# EAGLE design Bolt (EAGLE 9.6.2)

## Sheet 1 of 5: Power supply
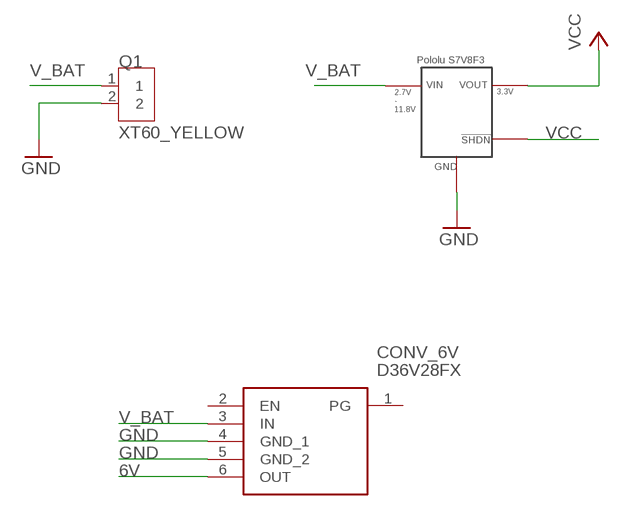
[diagram p0: schematic, sheet 1]

### Parts
CONV_3V3  S7V8F3  [S7V8F3]
CONV_6V  D36V28FX  [D36V28FX]
Q1  XT60_YELLOW  [AMASS_XT60PB-M]

### Nets
6V: CONV_6V.6(OUT) ; also sheet 3
GND: CONV_3V3.GND CONV_6V.4(GND_1) CONV_6V.5(GND_2) Q1.2 ; also sheet 2,3,4,5
V_BAT: CONV_3V3.VIN CONV_6V.3(IN) Q1.1
VCC: CONV_3V3.!SHDN CONV_3V3.VOUT ; also sheet 2,3,4,5
Unconnected: CONV_6V.1(PG) CONV_6V.2(EN)

## Sheet 2 of 5: MCU
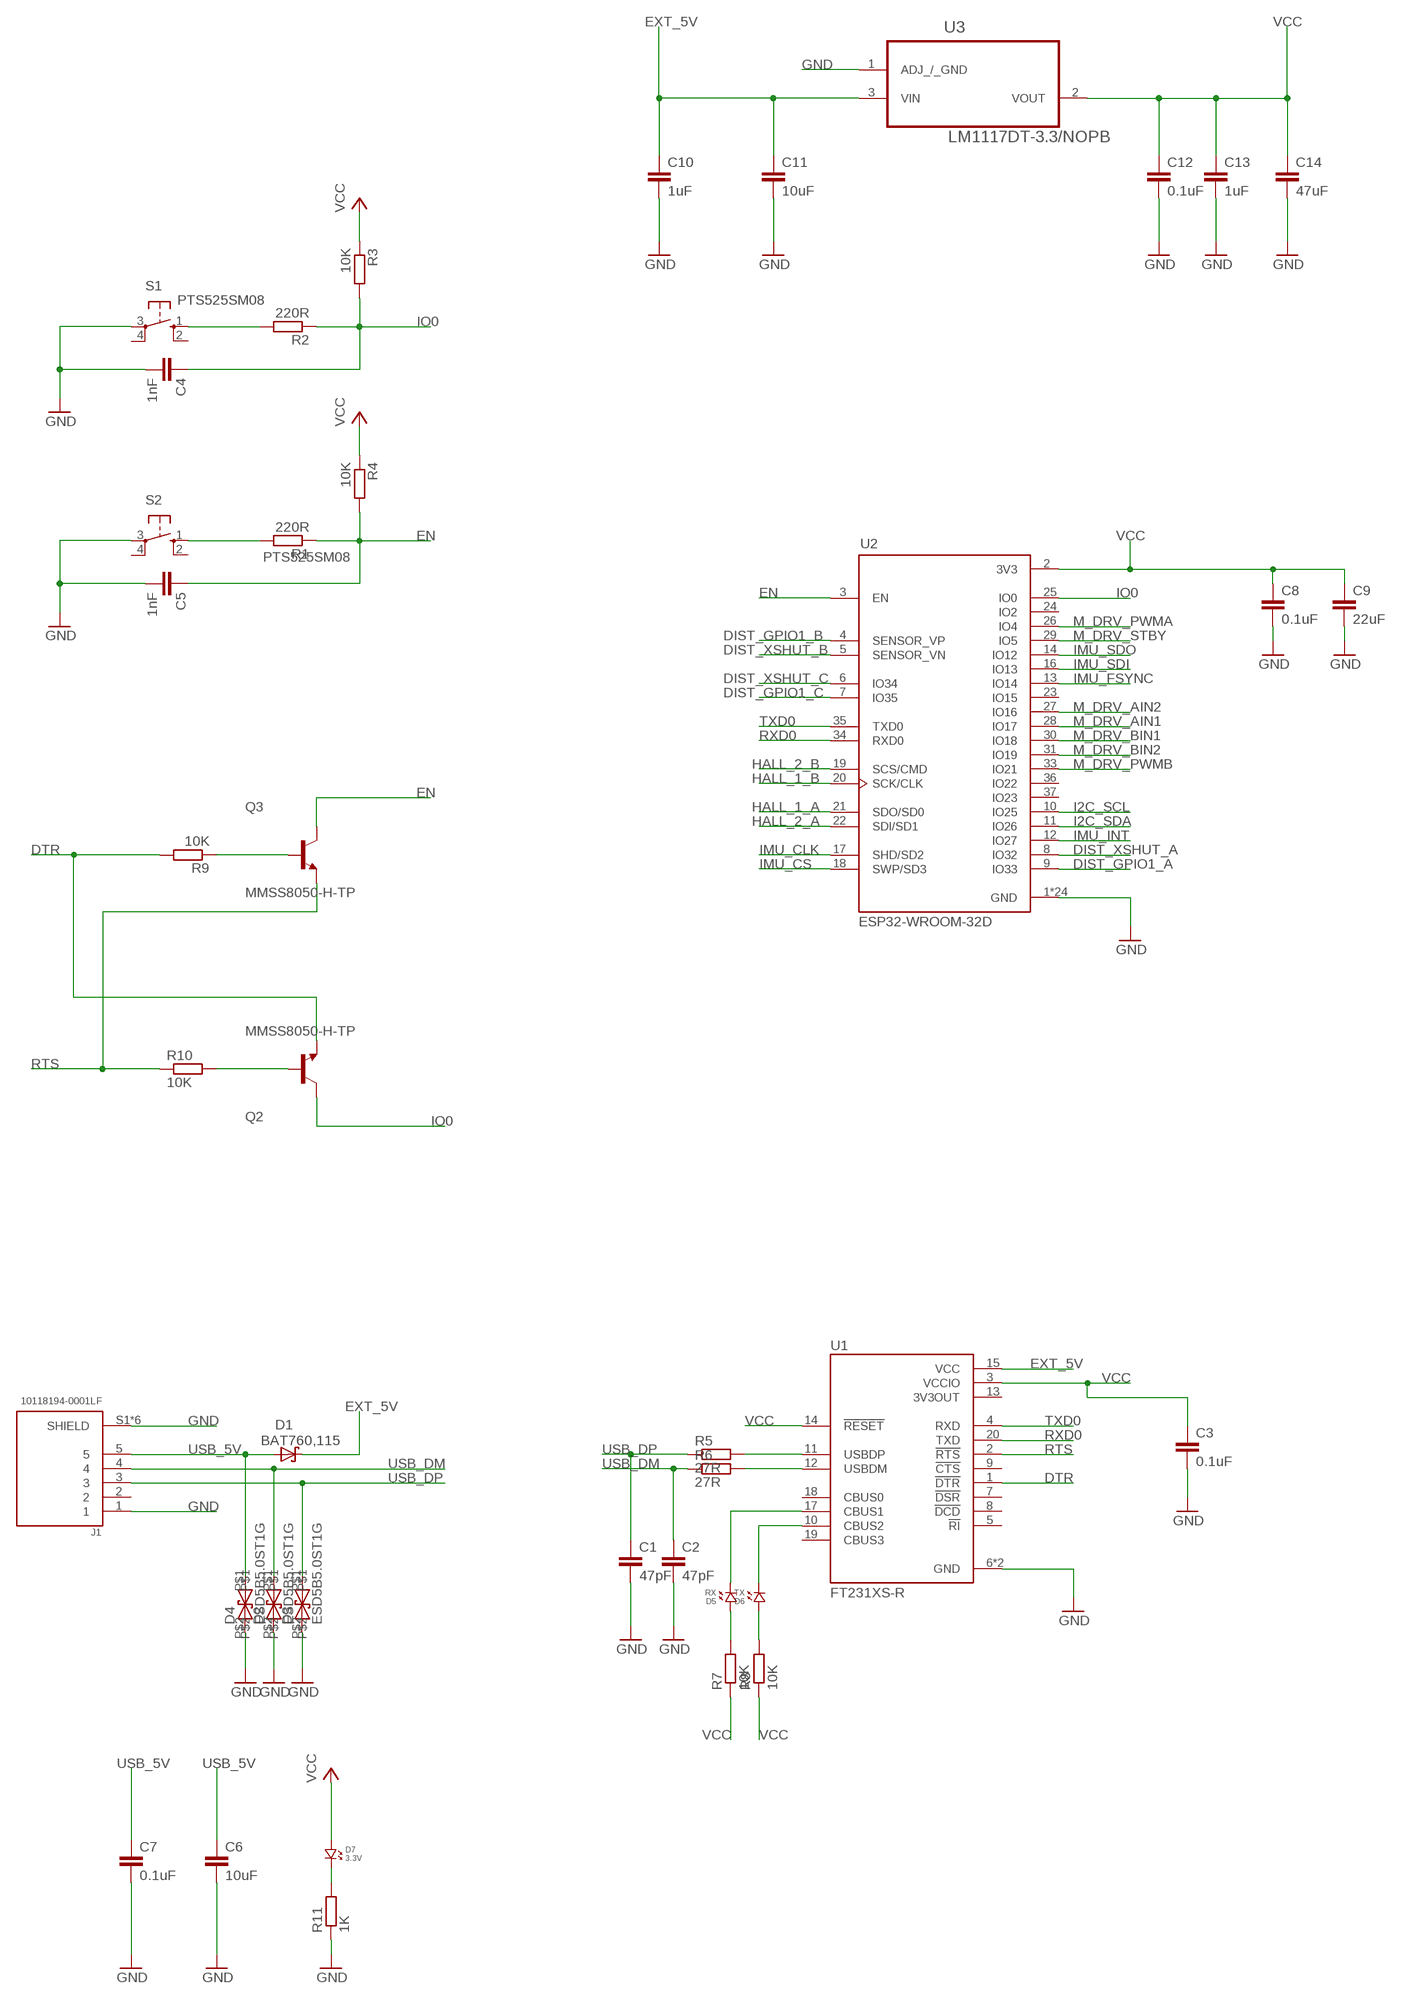
[diagram p1: schematic, sheet 2]

### Parts
C1  47pF  C-EUC0805K  [C0805K]
C2  47pF  C-EUC0805K  [C0805K]
C3  0.1uF  C-EUC0805K  [C0805K]
C4  1nF  C-EUC0805K  [C0805K]
C5  1nF  C-EUC0805K  [C0805K]
C6  10uF  C-EUC0805K  [C0805K]
C7  0.1uF  C-EUC0805K  [C0805K]
C8  0.1uF  C-EUC0805K  [C0805K]
C9  22uF  C-EUC0805K  [C0805K]
C10  1uF  C-EUC0805K  [C0805K]
C11  10uF  C-EUC0805K  [C0805K]
C12  0.1uF  C-EUC0805K  [C0805K]
C13  1uF  C-EUC0805K  [C0805K]
C14  47uF  C-EUC0805K  [C0805K]
D1  BAT760,115  [SOD323(F)]
D2  ESD5B5.0ST1G  [SOD-523]
D3  ESD5B5.0ST1G  [SOD-523]
D4  ESD5B5.0ST1G  [SOD-523]
D5  RX  LED.0805  [0805.LED]
D6  TX  LED.0805  [0805.LED]
D7  3.3V  LED.0805  [0805.LED]
J1  10118194-0001LF  [AMPHENOL_10118194-0001LF]
Q2  MMSS8050-H-TP  [TRANS_MMSS8050-H-TP]
Q3  MMSS8050-H-TP  [TRANS_MMSS8050-H-TP]
R1  220R  R-EU_R0805  [R0805]
R2  220R  R-EU_R0805  [R0805]
R3  10K  R-EU_R0805  [R0805]
R4  10K  R-EU_R0805  [R0805]
R5  27R  R-EU_R0805  [R0805]
R6  27R  R-EU_R0805  [R0805]
R7  10K  R-EU_R0805  [R0805]
R8  10K  R-EU_R0805  [R0805]
R9  10K  R-EU_R0805  [R0805]
R10  10K  R-EU_R0805  [R0805]
R11  1K  R-EU_R0805  [R0805]
S1  PTS525SM08  [SM08]
S2  PTS525SM08  [SM08]
U1  FT231XS-R  [SOP63P599X175-20N]
U2  ESP32-WROOM-32D  [MODULE_ESP32-WROOM-32D]
U3  LM1117DT-3.3/NOPB  [TO228P970X238-3N]

### Nets
DIST_GPIO1_A: U2.9(IO33) ; also sheet 5
DIST_GPIO1_B: U2.4(SENSOR_VP) ; also sheet 5
DIST_GPIO1_C: U2.7(IO35) ; also sheet 5
DIST_XSHUT_A: U2.8(IO32) ; also sheet 5
DIST_XSHUT_B: U2.5(SENSOR_VN) ; also sheet 5
DIST_XSHUT_C: U2.6(IO34) ; also sheet 5
DTR: Q2.2(E) R9.2 U1.1(!DTR)
EN: C5.1 Q3.3(C) R1.1 R4.2 U2.3(EN)
EXT_5V: C10.1 C11.1 D1.1(K) U1.15(VCC) U3.3(VIN)
GND: C1.2 C2.2 C3.2 C4.2 C5.2 C6.2 C7.2 C8.2 C9.2 C10.2 C11.2 C12.2 C13.2 C14.2 D2.P$2 D3.P$2 D4.P$2 J1.1 J1.S1(SHIELD) J1.S2(SHIELD) J1.S3(SHIELD) J1.S4(SHIELD) J1.S5(SHIELD) J1.S6(SHIELD) R11.1 S1.3(P) S2.3(P) U1.6(GND) U1.16(GND) U2.1(GND) U2.15(GND) U2.38(GND) U2.39_1(GND) U2.39_2(GND) U2.39_3(GND) U2.39_4(GND) U2.39_5(GND) U2.39_6(GND) U2.39_7(GND) U2.39_8(GND) U2.39_9(GND) U2.39_10(GND) U2.39_11(GND) U2.39_12(GND) U2.39_13(GND) U2.39_14(GND) U2.39_15(GND) U2.39_16(GND) U2.39_17(GND) U2.39_18(GND) U2.39_19(GND) U2.39_20(GND) U2.39_21(GND) U3.1(ADJ_/_GND) ; also sheet 1,3,4,5
HALL_1_A: U2.21(SDO/SD0) ; also sheet 5
HALL_1_B: U2.20(SCK/CLK) ; also sheet 5
HALL_2_A: U2.22(SDI/SD1) ; also sheet 5
HALL_2_B: U2.19(SCS/CMD) ; also sheet 5
I2C_SCL: U2.10(IO25) ; also sheet 5
I2C_SDA: U2.11(IO26) ; also sheet 5
IMU_CLK: U2.17(SHD/SD2) ; also sheet 4
IMU_CS: U2.18(SWP/SD3) ; also sheet 4
IMU_FSYNC: U2.13(IO14) ; also sheet 4
IMU_INT: U2.12(IO27) ; also sheet 4
IMU_SDI: U2.16(IO13) ; also sheet 4
IMU_SDO: U2.14(IO12) ; also sheet 4
IO0: C4.1 Q2.3(C) R2.1 R3.2 U2.25(IO0)
M_DRV_AIN1: U2.28(IO17) ; also sheet 3
M_DRV_AIN2: U2.27(IO16) ; also sheet 3
M_DRV_BIN1: U2.30(IO18) ; also sheet 3
M_DRV_BIN2: U2.31(IO19) ; also sheet 3
M_DRV_PWMA: U2.26(IO4) ; also sheet 3
M_DRV_PWMB: U2.33(IO21) ; also sheet 3
M_DRV_STBY: U2.29(IO5) ; also sheet 3
N$1: Q2.1(B) R10.2
N$28: D7.P$2 R11.2
N$35: D5.P$1 R7.2
N$55: R5.2 U1.11(USBDP)
N$56: R6.2 U1.12(USBDM)
N$61: R2.2 S1.1(S)
N$62: R1.2 S2.1(S)
N$124: Q3.1(B) R9.1
N$126: D5.P$2 U1.17(CBUS1)
N$127: D6.P$2 U1.10(CBUS2)
N$129: D6.P$1 R8.2
RTS: Q3.2(E) R10.1 U1.2(!RTS)
RXD0: U1.20(TXD) U2.34(RXD0)
TXD0: U1.4(RXD) U2.35(TXD0)
USB_5V: C6.1 C7.1 D1.2(A) D4.P$1 J1.5
USB_DM: C2.1 D2.P$1 J1.4 R6.1
USB_DP: C1.1 D3.P$1 J1.3 R5.1
VCC: C3.1 C8.1 C9.1 C12.1 C13.1 C14.1 D7.P$1 R3.1 R4.1 R7.1 R8.1 U1.3(VCCIO) U1.14(!RESET) U2.2(3V3) U3.2(VOUT) ; also sheet 1,3,4,5
Unconnected: J1.2 S1.2(S) S1.4(P) S2.2(S) S2.4(P) U1.5(!RI) U1.7(!DSR) U1.8(!DCD) U1.9(!CTS) U1.18(CBUS0) U1.19(CBUS3) U2.23(IO15) U2.24(IO2) U2.36(IO22) U2.37(IO23)

## Sheet 3 of 5: Motors driver
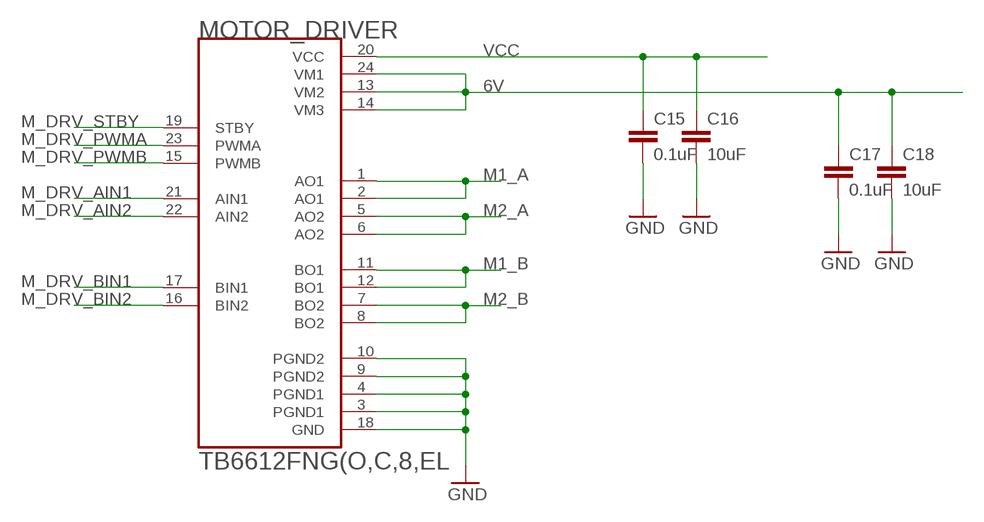
[diagram p2: schematic, sheet 3]

### Parts
C15  0.1uF  C-EUC0805K  [C0805K]
C16  10uF  C-EUC0805K  [C0805K]
C17  0.1uF  C-EUC0805K  [C0805K]
C18  10uF  C-EUC0805K  [C0805K]
MOTOR_DRIVER  TB6612FNG(O,C,8,EL  [SOP65P760X160-24N]

### Nets
6V: C17.1 C18.1 MOTOR_DRIVER.13(VM2) MOTOR_DRIVER.14(VM3) MOTOR_DRIVER.24(VM1) ; also sheet 1
GND: C15.2 C16.2 C17.2 C18.2 MOTOR_DRIVER.3(PGND1) MOTOR_DRIVER.4(PGND1) MOTOR_DRIVER.9(PGND2) MOTOR_DRIVER.10(PGND2) MOTOR_DRIVER.18(GND) ; also sheet 1,2,4,5
M1_A: MOTOR_DRIVER.1(AO1) MOTOR_DRIVER.2(AO1) ; also sheet 5
M1_B: MOTOR_DRIVER.11(BO1) MOTOR_DRIVER.12(BO1) ; also sheet 5
M2_A: MOTOR_DRIVER.5(AO2) MOTOR_DRIVER.6(AO2) ; also sheet 5
M2_B: MOTOR_DRIVER.7(BO2) MOTOR_DRIVER.8(BO2) ; also sheet 5
M_DRV_AIN1: MOTOR_DRIVER.21(AIN1) ; also sheet 2
M_DRV_AIN2: MOTOR_DRIVER.22(AIN2) ; also sheet 2
M_DRV_BIN1: MOTOR_DRIVER.17(BIN1) ; also sheet 2
M_DRV_BIN2: MOTOR_DRIVER.16(BIN2) ; also sheet 2
M_DRV_PWMA: MOTOR_DRIVER.23(PWMA) ; also sheet 2
M_DRV_PWMB: MOTOR_DRIVER.15(PWMB) ; also sheet 2
M_DRV_STBY: MOTOR_DRIVER.19(STBY) ; also sheet 2
VCC: C15.1 C16.1 MOTOR_DRIVER.20(VCC) ; also sheet 1,2,4,5

## Sheet 4 of 5: IMU
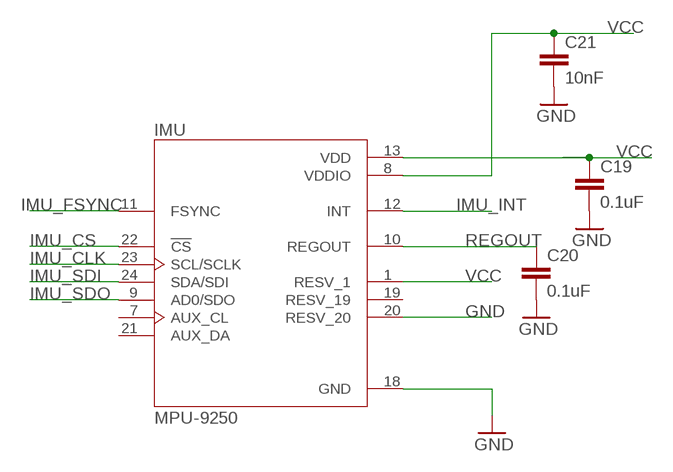
[diagram p3: schematic, sheet 4]

### Parts
C19  0.1uF  C-EUC0805K  [C0805K]
C20  0.1uF  C-EUC0805K  [C0805K]
C21  10nF  C-EUC0805K  [C0805K]
IMU  MPU-9250  [QFN40P300X300X105-24N]

### Nets
GND: C19.2 C20.2 C21.2 IMU.18(GND) IMU.20(RESV_20) ; also sheet 1,2,3,5
IMU_CLK: IMU.23(SCL/SCLK) ; also sheet 2
IMU_CS: IMU.22(!CS) ; also sheet 2
IMU_FSYNC: IMU.11(FSYNC) ; also sheet 2
IMU_INT: IMU.12(INT) ; also sheet 2
IMU_SDI: IMU.24(SDA/SDI) ; also sheet 2
IMU_SDO: IMU.9(AD0/SDO) ; also sheet 2
REGOUT: C20.1 IMU.10(REGOUT)
VCC: C19.1 C21.1 IMU.1(RESV_1) IMU.8(VDDIO) IMU.13(VDD) ; also sheet 1,2,3,5
Unconnected: IMU.7(AUX_CL) IMU.19(RESV_19) IMU.21(AUX_DA)

## Sheet 5 of 5: External pins
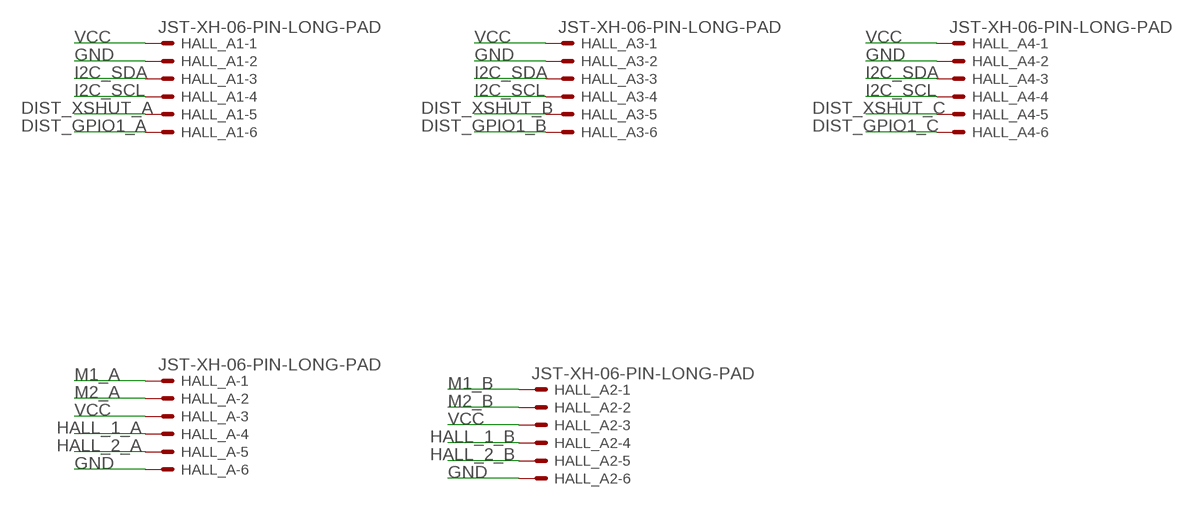
[diagram p4: schematic, sheet 5]

### Parts
HALL_A  JST-XH-06-PIN-LONG-PAD  [JST-XH-06-PACKAGE-LONG-PAD]
HALL_A1  JST-XH-06-PIN-LONG-PAD  [JST-XH-06-PACKAGE-LONG-PAD]
HALL_A2  JST-XH-06-PIN-LONG-PAD  [JST-XH-06-PACKAGE-LONG-PAD]
HALL_A3  JST-XH-06-PIN-LONG-PAD  [JST-XH-06-PACKAGE-LONG-PAD]
HALL_A4  JST-XH-06-PIN-LONG-PAD  [JST-XH-06-PACKAGE-LONG-PAD]

### Nets
DIST_GPIO1_A: HALL_A1.6 ; also sheet 2
DIST_GPIO1_B: HALL_A3.6 ; also sheet 2
DIST_GPIO1_C: HALL_A4.6 ; also sheet 2
DIST_XSHUT_A: HALL_A1.5 ; also sheet 2
DIST_XSHUT_B: HALL_A3.5 ; also sheet 2
DIST_XSHUT_C: HALL_A4.5 ; also sheet 2
GND: HALL_A1.2 HALL_A2.6 HALL_A3.2 HALL_A4.2 HALL_A.6 ; also sheet 1,2,3,4
HALL_1_A: HALL_A.4 ; also sheet 2
HALL_1_B: HALL_A2.4 ; also sheet 2
HALL_2_A: HALL_A.5 ; also sheet 2
HALL_2_B: HALL_A2.5 ; also sheet 2
I2C_SCL: HALL_A1.4 HALL_A3.4 HALL_A4.4 ; also sheet 2
I2C_SDA: HALL_A1.3 HALL_A3.3 HALL_A4.3 ; also sheet 2
M1_A: HALL_A.1 ; also sheet 3
M1_B: HALL_A2.1 ; also sheet 3
M2_A: HALL_A.2 ; also sheet 3
M2_B: HALL_A2.2 ; also sheet 3
VCC: HALL_A1.1 HALL_A2.3 HALL_A3.1 HALL_A4.1 HALL_A.3 ; also sheet 1,2,3,4

## Power pins joined to a net without a drawn wire
3V3OUT: U1.13(3V3OUT)

## Library data of the parts
C1-C21 = rcl:C-EU: CAPACITOR, European symbol; SPICEPREFIX: C
CONV_3V3 = Pololu_S7V8F3:S7V8F3: Pololu S7V8F3 - Pololu 3.3V Step-Up/Step-Down Voltage Regulator S7V8F3 - The S7V8F3 switching step-up/step-down regulator efficiently produces a fixed 3.3 V output from input voltages between 2.7 V and 11.8 V. Its ability to convert both higher and lower input voltages makes it useful for applications where the power supply voltage can vary greatly, as with batteries that start above but discharge below the regulated voltage. The compact module has a typical efficiency of over 90% and can deliver 500 mA to 1 A across most of the input voltage range.
CONV_6V = D36V28FX:D36V28FX: 5V, 3.2A Step-Down Voltage Regulator D36V28F5 Source: Datasheet <https://www.pololu.com/product/3782>; DESCRIPTION: 5V, 3.2A Step-Down Voltage Regulator D36V28F5; HEIGHT: 8.77mm; MANUFACTURER_NAME: POLOLU ROBOTICS & ELECTRONICS; MANUFACTURER_PART_NUMBER: D36V28FX
D1 = BAT760_115:BAT760,115: Medium power Schottky barrier single diode Planar medium power Schottky barrier single diode with an integrated guard ring for stress protection, encapsulated in a SOD323 (SC-76) very small Surface-Mounted Device SMD plastic package. AAL Eindhoven MK Check prices <https://pricing.snapeda.com/parts/BAT760%2C115/Nexperia%20USA/view-part?ref=eda>; AVAILABILITY: Good; DESCRIPTION: Diode Schottky 20V 1A (DC) Surface Mount SOD-323; MF: Nexperia USA; MP: BAT760,115; PACKAGE: SOD323-2 Nexperia USA Inc.; PRICE: None; PURCHASE-URL: https://pricing.snapeda.com/search/part/BAT760,115/?ref=eda
D2-D4 = ESD5B5.0ST1G:ESD5B5.0ST1G: Medium power Schottky barrier single diode Planar medium power Schottky barrier single diode with an integrated guard ring for stress protection, encapsulated in a SOD323 (SC-76) very small Surface-Mounted Device SMD plastic package. AAL Eindhoven MK Check prices <https://pricing.snapeda.com/parts/BAT760%2C115/Nexperia%20USA/view-part?ref=eda>; AVAILABILITY: Good; DESCRIPTION: Diode Schottky 20V 1A (DC) Surface Mount SOD-323; MF: Nexperia USA; MP: BAT760,115; PACKAGE: SOD323-2 Nexperia USA Inc.; PRICE: None; PURCHASE-URL: https://pricing.snapeda.com/search/part/BAT760,115/?ref=eda
D5-D7 = leds:LED
HALL_A HALL_A1-HALL_A4 = Rembrandt Electronics - JST XH Connectors v1-0:JST-XH-06-PIN: JST XH Connector 2 Pin Wire to board connector. Pitch: 2,54 mm, (0.100") Number of pins: 6 Created by Rembrandt Electronics www.rembrandtelectronics.com
IMU = MPU-9250:MPU-9250: Axis=3 Axis Gyro+3 Axis Accel+Compass. Pin For Pin With m Check prices <https://pricing.snapeda.com/parts/MPU-9250/TDK%20InvenSense/view-part?ref=eda>; AVAILABILITY: Bad; DESCRIPTION: Accelerometer, Gyroscope, Magnetometer, 9 Axis Sensor I²C, SPI Output; MF: TDK InvenSense; MP: MPU-9250; PACKAGE: TFQFN-24 TDK InvenSense; PRICE: None
J1 = 10118194-0001LF:10118194-0001LF: Micro Usb, 2.0 Type b, Rcpt, Smt Check prices <https://pricing.snapeda.com/parts/10118194-0001LF/Amphenol%20ICC%20%28FCI%29/view-part?ref=eda>; AVAILABILITY: Good; DESCRIPTION: USB - micro B USB 2.0 Receptacle Connector 5 Position Surface Mount, Right Angle; Through Hole; MF: Amphenol ICC (FCI); MP: 10118194-0001LF; PACKAGE: None; PRICE: None; PURCHASE-URL: https://pricing.snapeda.com/search/part/10118194-0001LF/?ref=eda
MOTOR_DRIVER = TB6612FNG_O_C_8_EL:TB6612FNG(O,C,8,EL: Stepping Motor Driver Ic Unipolor Copper Wire 8" Check prices <https://pricing.snapeda.com/parts/TB6612FNG%28O%2CC%2C8%2CEL/Toshiba/view-part?ref=eda>; AVAILABILITY: Good; DESCRIPTION: Motor Driver Power MOSFET Parallel 24-SSOP; MF: Toshiba; MP: TB6612FNG(O,C,8,EL; PACKAGE: SSOP-24 Toshiba; PRICE: None
Q1 = XT60_YELLOW:XT60_YELLOW: Connector 2 pins; AVAILABILITY: Unavailable; DESCRIPTION: Power connector; 65A; PIN: 2; Colour: yellow; MF: Pololu; MP: XT60 YELLOW; PACKAGE: None; PRICE: None
Q2 Q3 = MMSS8050-H-TP:MMSS8050-H-TP: MMSS8050-H Series 25 V 1.5 A NPN Silicon Plastic-Encapsulate Transistor-SOT-23 Check prices <https://pricing.snapeda.com/parts/MMSS8050-H-TP/Micro%20Commercial/view-part?ref=eda>; AVAILABILITY: Good; DESCRIPTION: Bipolar (BJT) Transistor NPN 25V 1.5A 100MHz 625mW Surface Mount SOT-23; MF: Micro Commercial; MP: MMSS8050-H-TP; PACKAGE: SOT-23 MCC; PRICE: None; PURCHASE-URL: https://pricing.snapeda.com/search/part/MMSS8050-H-TP/?ref=eda
R1-R11 = rcl:R-EU_: RESISTOR, European symbol; SPICEPREFIX: R
S1 S2 = pts525_20:PTS525*: PTS 525 Series Miniature Tact Switch for SMD Source: http://www.ck-components.com/14407/pts525_8sept14.pdf/; MF: C&K Components; MPN: PTS525SM08SMTR2LFS; OC_FARNELL: unknown; OC_NEWARK: unknown
U1 = FT231XS-R:FT231XS-R: USB Full Speed to Full Handshake UART with USB Charger Detection; DESCRIPTION: USB Bridge, USB to UART USB 2.0 UART Interface 20-SSOP; DIGI-KEY_PART_NUMBER: 768-1129-1-ND; MF: FTDI,; MP: FT231XS-R; PACKAGE: SSOP-20 FTDI; PURCHASE-URL: https://pricing.snapeda.com/search/part/FT231XS-R/?ref=eda
U2 = ESP32-WROOM-32D:ESP32-WROOM-32D: Bluetooth, WiFi 802.11b/g/n, Bluetooth v4.2 + EDR, Class 1, 2 and 3 Transceiver Module 2.4GHz ~ 2.5GHz Integrated, Trace Surface Mount Check prices <https://pricing.snapeda.com/parts/ESP32-WROOM-32D/Espressif%20Systems/view-part?ref=eda>; AVAILABILITY: Bad; DESCRIPTION: Bluetooth, WiFi 802.11b/g/n, Bluetooth v4.2 +EDR, Class 1, 2 and 3 Transceiver Module 2.4GHz ~ 2.5GHz Integrated, Trace Surface Mount; MF: Espressif Systems; MP: ESP32-WROOM-32D; PACKAGE: Module Espressif Systems; PRICE: None
U3 = LM1117DT-3.3_NOPB:LM1117DT-3.3/NOPB: IC, LDO VOLT REG, 3.3V, 0.8A Check prices <https://pricing.snapeda.com/parts/LM1117DT-3.3/NOPB/Texas%20Instruments/view-part?ref=eda>; AVAILABILITY: Good; DESCRIPTION: 800-mA 15-V linear voltage regulator 3-TO-252 0 to 125; MF: Texas Instruments; MP: LM1117DT-3.3/NOPB; PACKAGE: TO-252-3 Texas Instruments; PRICE: None; PURCHASE-URL: https://pricing.snapeda.com/search/part/LM1117DT-3.3/NOPB/?ref=eda

## Board
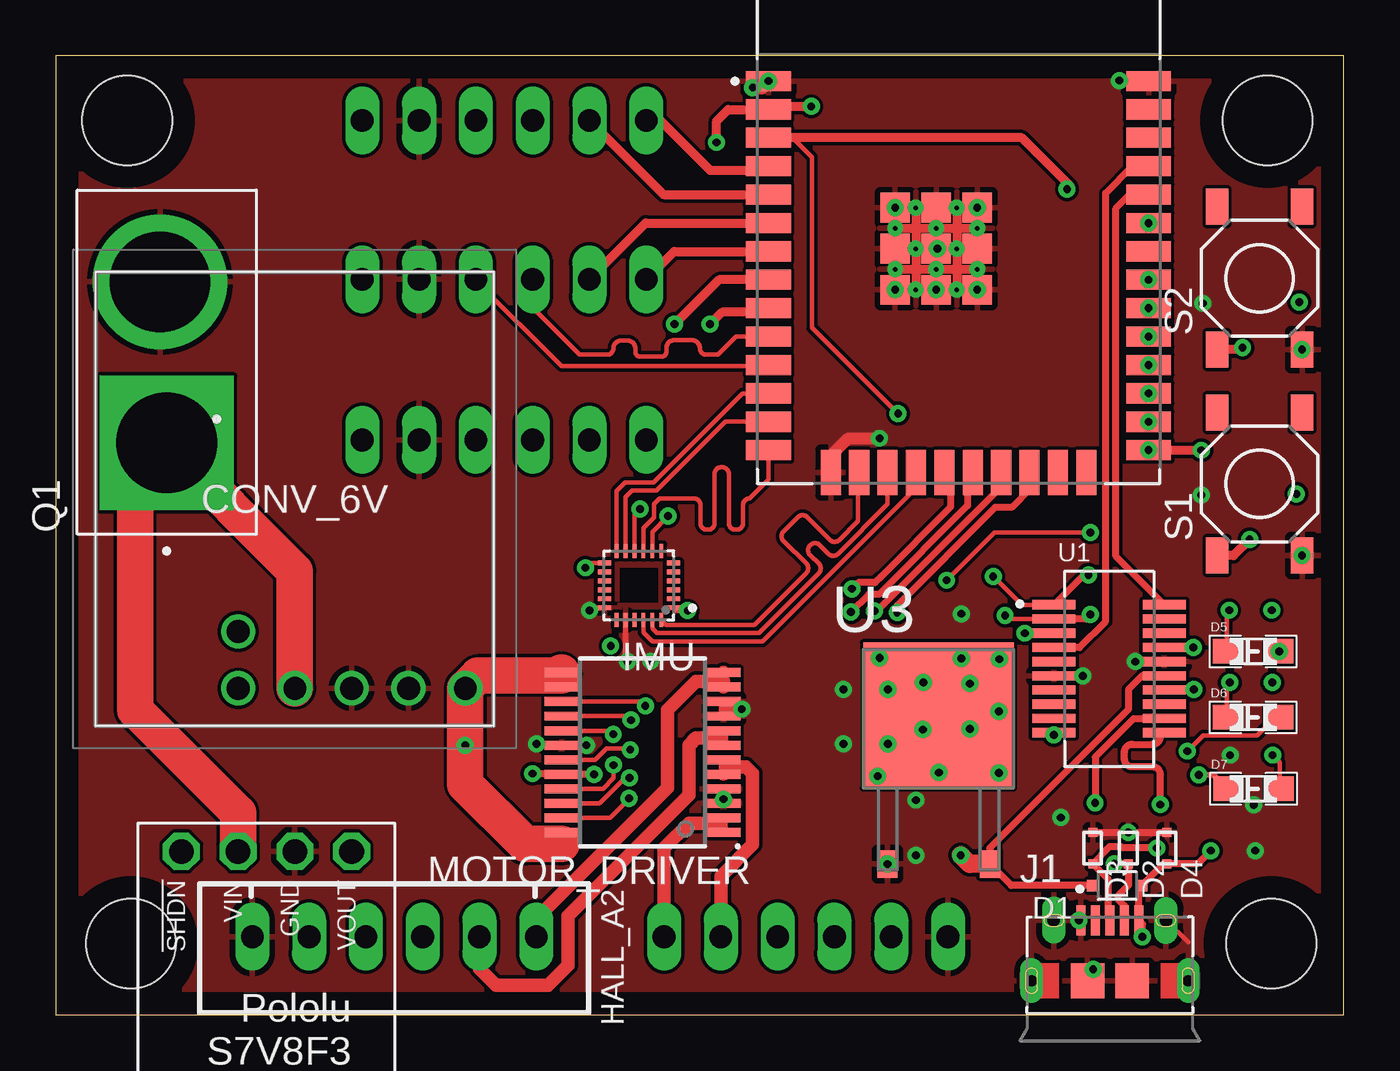
[diagram p5: board, top side]
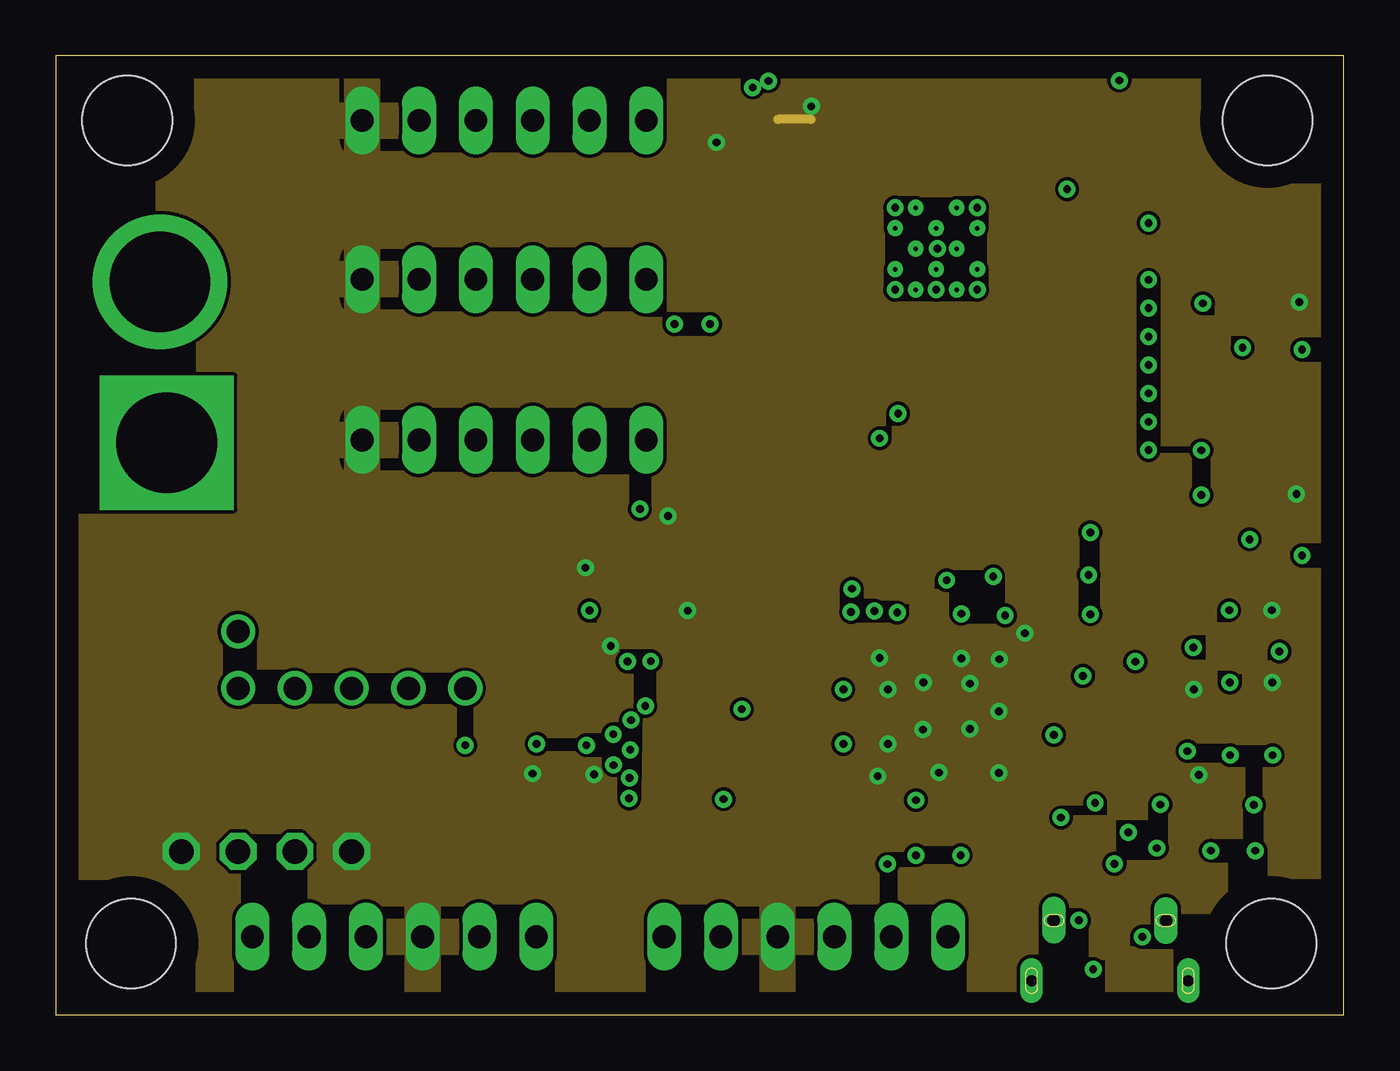
[diagram p6: board, inner layer VCC]
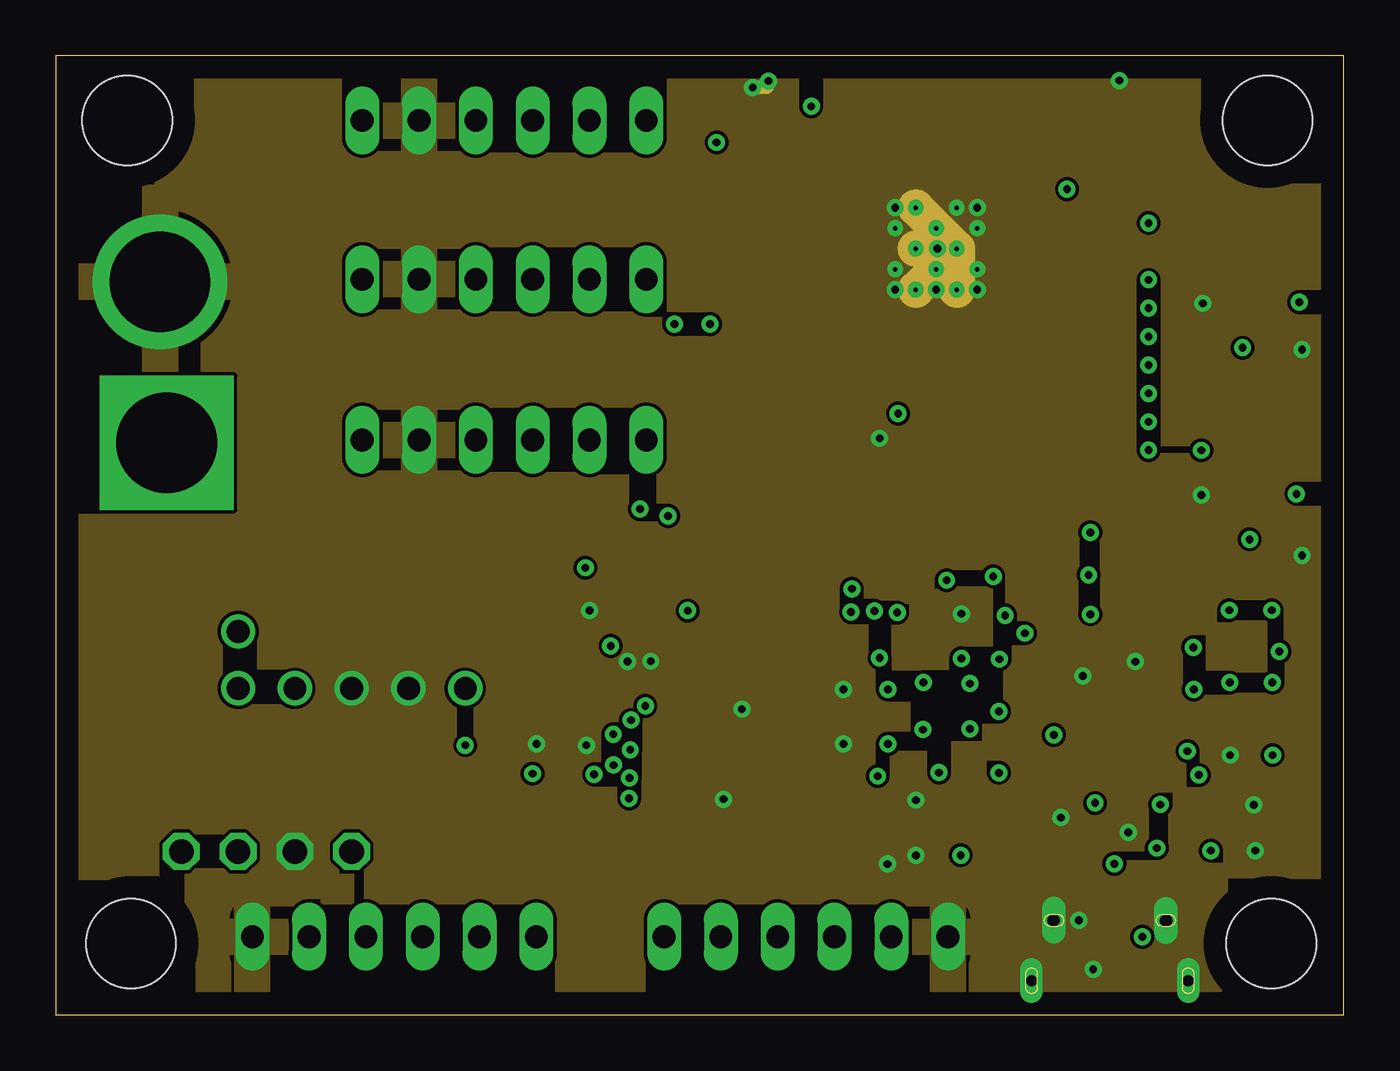
[diagram p7: board, inner layer GND]
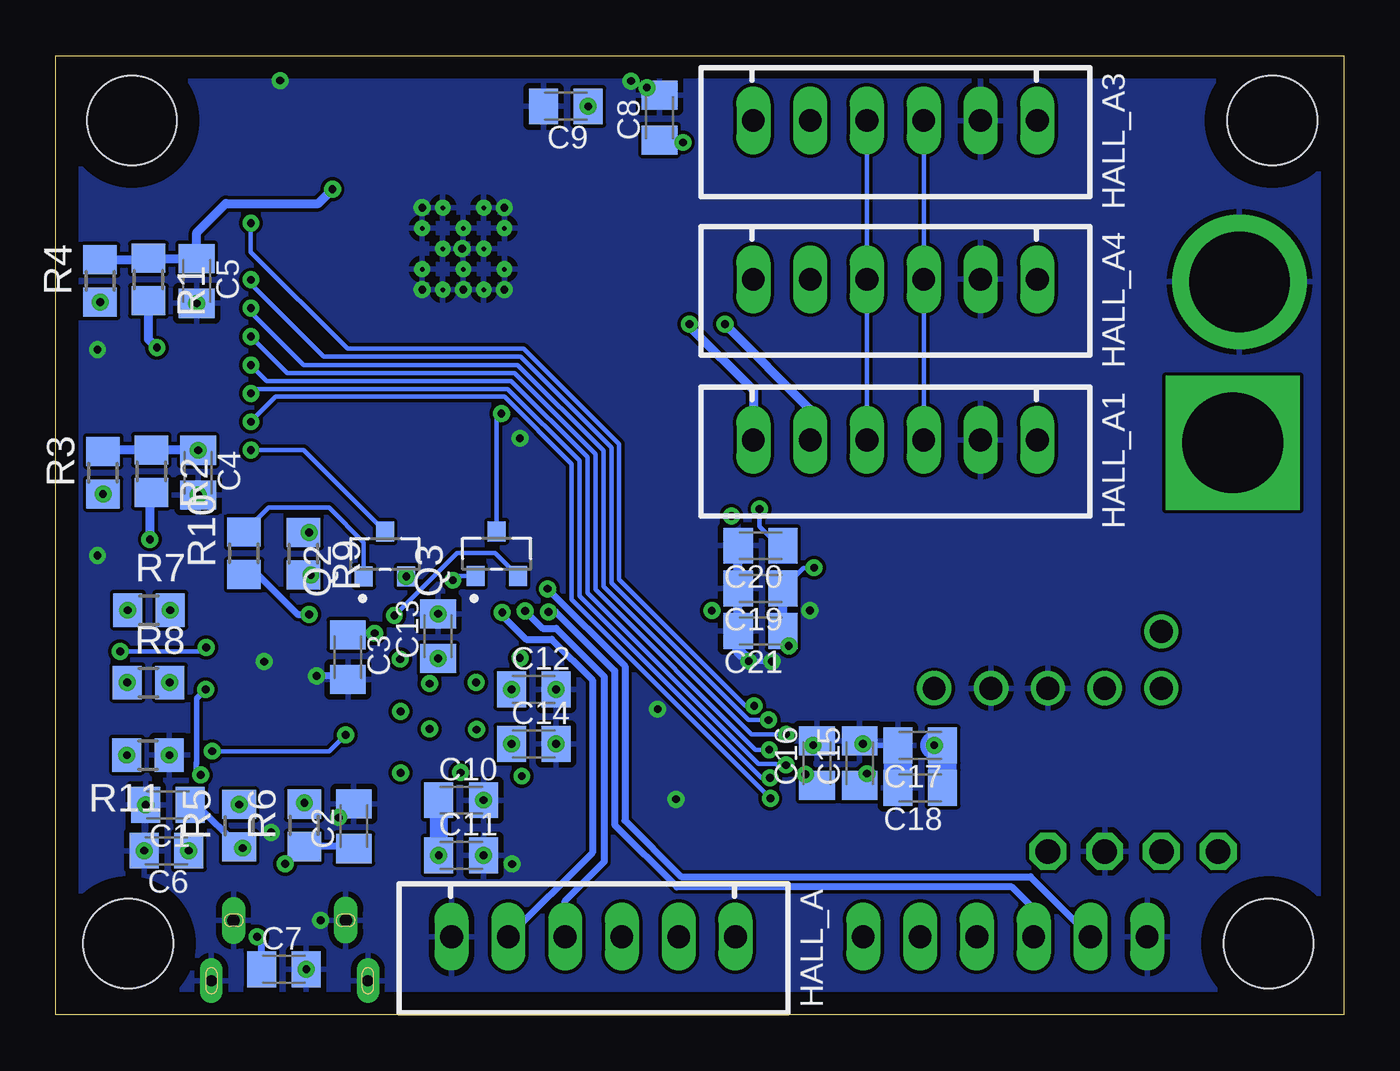
[diagram p8: board, bottom side, seen from below]

Size 57.59 x 42.9 mm. Coordinates in mm from the lower left corner, seen from the top.
Outline: 0,0 57.59,0 57.59,42.9 0,42.9 0,0
Copper layers (1+2*15+16): Top 0.035mm / dielectric 1.5mm / VCC 0.035mm / dielectric 0.15mm / GND 0.035mm / dielectric 0.2mm / Bottom 0.035mm
Design rules "default *": minimum track width 6mil, minimum drill 0.2mm, track to track 6mil, track to pad 6mil, pad to pad 6mil, via to via 6mil, smd to smd 6mil, copper to edge 40mil, drill to drill 6mil, minimum pad ring 10mil, minimum via ring 8mil, stop-mask expansion 4mil, vias tented up to drill 0mil, thermal gap 10mil
Holes 4 mm at 3.35,3.19 3.19,40.01 54.19,40.01 54.35,3.19

### Footprints (pad centres in the part's own frame; a part is rotated, then mirrored left to right if it is on the bottom)
C0805K = smd 1.3 x 1.6: 1 -1,0; 2 1,0
S7V8F3 = drill 1.1 octagon: !SHDN 3.81,0; GND -1.27,0; VIN 1.27,0; VOUT -3.81,0
D36V28FX = drill 1.02 pad 1.53: 1 0,0; 2 0,-2.54; 3 2.54,-2.54; 4 5.08,-2.54; 5 7.62,-2.54; 6 10.16,-2.54
SOD323(F) = smd 0.5 x 0.5: 1 1.1,0; 2 -1.1,0
SOD-523 = smd 0.4 x 0.4: P$1 0,-0.5; P$2 1.4,-0.5
0805.LED = smd 1.25 x 1.1: P$1 -1.175,0; P$2 1.175,0
JST-XH-06-PACKAGE-LONG-PAD = drill 1.016 long: 1 -6.35,0; 2 -3.81,0; 3 -1.27,0; 4 1.27,0; 5 3.81,0; 6 6.35,0
QFN40P300X300X105-24N = smd 0.64 x 0.22: 1 -1.545,1; 2 -1.545,0.6; 3 -1.545,0.2; 4 -1.545,-0.2; 5 -1.545,-0.6; 6 -1.545,-1; 13 1.545,-1; 14 1.545,-0.6; 15 1.545,-0.2; 16 1.545,0.2; 17 1.545,0.6; 18 1.545,1 | smd 0.22 x 0.64: 7 -1,-1.545; 8 -0.6,-1.545; 9 -0.2,-1.545; 10 0.2,-1.545; 11 0.6,-1.545; 12 1,-1.545; 19 1,1.545; 20 0.6,1.545; 21 0.2,1.545; 22 -0.2,1.545; 23 -0.6,1.545; 24 -1,1.545
AMPHENOL_10118194-0001LF = smd 0.4 x 1.35: 1 -1.3,2.7; 2 -0.65,2.7; 3 0,2.7; 4 0.65,2.7; 5 1.3,2.7 | drill 0.55 pad 0.65 long: S1 -2.511,2.706; S2 2.514,2.697 | drill 0.5 pad 0.775 long: S3 -3.5,0; S6 3.5,0 | smd 1.5 x 1.55: S4 -1,0; S5 1,0
SOP65P760X160-24N = smd 1.5 x 0.4: 1 -3.625,3.575; 2 -3.625,2.925; 3 -3.625,2.275; 4 -3.625,1.625; 5 -3.625,0.975; 6 -3.625,0.325; 7 -3.625,-0.325; 8 -3.625,-0.975; 9 -3.625,-1.625; 10 -3.625,-2.275; 11 -3.625,-2.925; 12 -3.625,-3.575; 13 3.625,-3.575; 14 3.625,-2.925; 15 3.625,-2.275; 16 3.625,-1.625; 17 3.625,-0.975; 18 3.625,-0.325; 19 3.625,0.325; 20 3.625,0.975; 21 3.625,1.625; 22 3.625,2.275; 23 3.625,2.925; 24 3.625,3.575
AMASS_XT60PB-M = drill 4.5 pad 6 square: 1 -3.6,0 | drill 4.5 pad 6: 2 3.6,0.305
TRANS_MMSS8050-H-TP = smd 0.9 x 0.8: 1 -1,0.95; 2 -1,-0.95; 3 1,0
R0805 = smd 1.3 x 1.5: 1 -0.95,0; 2 0.95,0
SM08 = smd 1.6 x 1: 1 -3.2,1.9; 2 3.2,1.9; 3 -3.2,-1.9; 4 3.2,-1.9
SOP63P599X175-20N = smd 1.97 x 0.41: 1 -2.47,2.857; 2 -2.47,2.223; 3 -2.47,1.587; 4 -2.47,0.953; 5 -2.47,0.318; 6 -2.47,-0.318; 7 -2.47,-0.953; 8 -2.47,-1.587; 9 -2.47,-2.223; 10 -2.47,-2.857; 11 2.47,-2.857; 12 2.47,-2.223; 13 2.47,-1.587; 14 2.47,-0.953; 15 2.47,-0.318; 16 2.47,0.318; 17 2.47,0.953; 18 2.47,1.587; 19 2.47,2.223; 20 2.47,2.857
MODULE_ESP32-WROOM-32D = smd 2 x 0.9: 1 -8.5,5.26; 2 -8.5,3.99; 3 -8.5,2.72; 4 -8.5,1.45; 5 -8.5,0.18; 6 -8.5,-1.09; 7 -8.5,-2.36; 8 -8.5,-3.63; 9 -8.5,-4.9; 10 -8.5,-6.17; 11 -8.5,-7.44; 12 -8.5,-8.71; 13 -8.5,-9.98; 14 -8.5,-11.25; 25 8.5,-11.25; 26 8.5,-9.98; 27 8.5,-8.71; 28 8.5,-7.44; 29 8.5,-6.17; 30 8.5,-4.9; 31 8.5,-3.63; 32 8.5,-2.36; 33 8.5,-1.09; 34 8.5,0.18; 35 8.5,1.45; 36 8.5,2.72; 37 8.5,3.99; 38 8.5,5.26 | smd 0.9 x 2: 15 -5.715,-12.25; 16 -4.445,-12.25; 17 -3.175,-12.25; 18 -1.905,-12.25; 19 -0.635,-12.25; 20 0.635,-12.25; 21 1.905,-12.25; 22 3.175,-12.25; 23 4.445,-12.25; 24 5.715,-12.25 | smd 1.33 x 1.33: 39_1 -2.835,-0.405; 39_2 -1,-0.405; 39_3 0.835,-0.405; 39_4 -2.835,-2.24; 39_5 -1,-2.24; 39_6 0.835,-2.24; 39_7 -2.835,-4.075; 39_8 -1,-4.075; 39_9 0.835,-4.075 | drill 0.2 pad 0.3: 39_10 -1.917,-0.405; 39_11 -0.083,-0.405; 39_12 -2.835,-1.323; 39_13 -1,-1.323; 39_14 0.835,-1.323; 39_15 -1.917,-2.24; 39_16 -0.083,-2.24; 39_17 -2.835,-3.158; 39_18 -1,-3.158; 39_19 0.835,-3.158; 39_20 -1.917,-4.075; 39_21 -0.083,-4.075
TO228P970X238-3N = smd 0.889 x 1.219: 1 -2.286,-6.502; 3 2.286,-6.502 | smd 6.731 x 6.502: 2 0,0.152

### Placement (x,y rotation side)
C1  52.58,9.4 180 bottom
C2  44.27,8.44 90 bottom
C3  44.53,16 270 bottom
C4  51.23,24.26 270 bottom
C5  51.29,32.83 270 bottom
C6  52.65,7.35 180 bottom
C7  47.39,2.04 0 bottom
C8  30.59,40.13 90 bottom
C9  34.78,40.64 180 bottom
C10  39.47,9.61 0 bottom
C11  39.47,7.14 0 bottom
C12  36.21,14.56 0 bottom
C13  40.49,16.94 90 bottom
C14  36.21,12.12 0 bottom
C15  21.64,11.27 90 bottom
C16  23.55,11.27 90 bottom
C17  18.94,12.06 180 bottom
C18  18.94,10.15 180 bottom
C19  26.08,19.08 180 bottom
C20  26.08,20.99 180 bottom
C21  26.08,17.18 180 bottom
CONV_3V3  9.42,7.31 180 top
CONV_6V  8.15,17.15 0 top
D1  47.46,5.79 180 top
D2  47.47,6.76 90 top
D3  45.87,6.76 90 top
D4  49.19,6.76 90 top
D5  53.55,16.26 0 top
D6  53.55,13.31 0 top
D7  53.56,10.12 0 top
HALL_A  33.55,3.5 180 bottom
HALL_A1  20.05,25.72 180 bottom
HALL_A2  15.13,3.5 180 top
HALL_A3  20.05,40.01 180 bottom
HALL_A4  20.05,32.91 180 bottom
IMU  26.08,19.21 180 top
J1  47.14,1.53 0 top
MOTOR_DRIVER  26.24,11.74 180 top
Q1  4.96,29.19 90 top
Q2  42.87,20.62 90 bottom
Q3  37.88,20.63 90 bottom
R1  53.45,32.89 270 bottom
R2  53.32,24.32 270 bottom
R3  55.48,24.26 90 bottom
R4  55.61,32.83 90 bottom
R5  49.39,8.46 90 bottom
R6  46.49,8.48 90 bottom
R7  53.42,18.1 0 bottom
R8  53.45,14.87 0 bottom
R9  46.52,20.64 270 bottom
R10  49.17,20.65 90 bottom
R11  53.47,11.62 180 bottom
S1  53.83,23.75 90 top
S2  53.83,32.96 90 top
U1  47.1,15.49 0 top
U2  40.37,36.51 0 top
U3  39.48,13.25 0 top

### Tracks (layer width: path | path; a pad name or v marks a point on that pad's centre or on a via)
6V  (via drill 0.35)
  Top 0.508: MOTOR_DRIVER.24 22.61,7.65 | MOTOR_DRIVER.14 MOTOR_DRIVER.13
  Top 1.626: 22.61,7.65 20.97,7.65 18.31,10.31 v18.31,12.06 CONV_6V.6 18.88,15.18 22.61,15.18 MOTOR_DRIVER.13
  Bottom 1.27: C18.1 C17.1 17.94,12.06 v18.31,12.06
DIST_GPIO1_A  (via drill 0.35)
  Top 0.406: U2.9 31.69,31.43 29.79,31.43 v29.26,30.9
  Bottom 0.406: v29.26,30.9 29.26,30.8 26.4,27.94 HALL_A1.6
DIST_GPIO1_B
  Top 0.406: HALL_A3.6 27.04,40.01 29.26,37.78 31.69,37.78 U2.4
DIST_GPIO1_C
  Top 0.406: HALL_A4.6 27.65,34.15 U2.7
DIST_XSHUT_A  (via drill 0.35)
  Top 0.406: U2.8 29.66,32.88 v27.67,30.9
  Bottom 0.406: v27.67,30.9 23.86,27.09 HALL_A1.5
DIST_XSHUT_B
  Top 0.406: HALL_A3.5 27.17,36.69 U2.5
DIST_XSHUT_C
  Top 0.406: HALL_A4.5 26.38,35.42 U2.6
DTR  (via drill 0.35)
  Top 0.203: Q2.2 43.2,18.34 U1.1
  Top 0.305: U1.1 45.97,19.69 v46.19,19.69
  Bottom 0.305: v46.19,19.69 R9.2
  other vias: 41.92,19.62
EN  (via drill 0.35)
  Top 0.203: v37.67,26.9 33.82,30.75 33.82,38.37 32.95,39.23 32.34,39.23
  Top 0.406: v45.22,36.93 45.36,37.07 43.2,39.23 32.34,39.23 U2.3
  Bottom 0.203: Q3.3 37.88,26.69 v37.67,26.9
  Bottom 0.406: R4.2 53.52,33.78 R1.1 53.44,33.83 C5.1 51.29,35 50,36.29 45.86,36.29 v45.22,36.93
EXT_5V  (via drill 0.35)
  Top 0.305: D1.1 42.73,5.79 U3.3 41.76,7.47 47.96,13.67 47.96,14.56 48.57,15.17 U1.15
  Top 0.813: U3.3 40.86,6.75 C11.1
  Bottom 0.813: C10.1 C11.1
  other vias: 40.47,7.14
GND  (via drill 0.35)
  Top 0.203: J1.S4 46.14,1.79 C7.2 | 50.64,3.24 J1.S2
  Top 0.254: MOTOR_DRIVER.3 v29.86,9.65 MOTOR_DRIVER.4 | MOTOR_DRIVER.10 29.86,13.68 30.18,13.68 | v30.68,13.68 30.18,13.68 | MOTOR_DRIVER.9 30.18,13.68 | IMU.18 23.98,18.21 v23.86,18.1 | IMU.20 25.49,15.9 v25.57,15.81 | MOTOR_DRIVER.18 21.56,12.06 v21.5,12.12
  Top 0.305: D3.P$2 D2.P$2 D4.P$2 | J1.1 v45.76,4.23 | v45.93,15.17 U1.6 | U1.16 v48.28,15.8
  Top 0.406: U2.39_5 v39.42,34.27 | MOTOR_DRIVER.9 MOTOR_DRIVER.10 | v47.56,41.8 48.85,41.8 U2.38 | U2.39_11 U2.39_3 U2.39_14 | U2.39_10 U2.39_1 U2.39_12 | U2.39_10 U2.39_2 | U2.39_2 U2.39_11 | U2.39_12 U2.39_13 | U2.39_13 U2.39_14 | U2.39_14 U2.39_6 U2.39_19 | U2.39_19 U2.39_9 U2.39_21 40.17,32.44 | 40.17,32.44 U2.39_8 | U2.39_8 U2.39_20 | U2.39_20 U2.39_7 U2.39_17 | U2.39_17 U2.39_4 U2.39_12 | U2.39_10 U2.39_15 U2.39_20 | U2.39_8 U2.39_18 | U2.39_18 U2.39_5 | U2.39_5 U2.39_13 | U2.39_13 U2.39_2 | U2.39_11 U2.39_16 40.29,32.56 40.17,32.44 | U2.39_17 U2.39_18 | U2.39_18 U2.39_19
  Top 0.508: U2.15 34.66,25.02 35.43,25.79 v36.84,25.79
  Top 0.61: U2.1 31.45,41.77 v31.16,41.48 31.58,41.48 U2.1
  GND 0.406: U2.1 31.87,41.58 31.8,41.5
  GND 0.61: v31.16,41.48 31.18,41.5 31.8,41.5
  GND 1.626: U2.39_15 v39.42,34.27 U2.39_16 | U2.39_10 U2.39_16 | U2.39_16 U2.39_21 U2.39_18 U2.39_20
  Bottom 0.203: 19.94,11.75 C17.2
  Bottom 0.254: C2.2 44.34,9.44 v44.95,8.83 | v21.5,12.12 C15.2 21.44,12.06 C17.2 | v26.6,15.82 v26.59,15.81 v25.57,15.81
  Bottom 0.305: C1.2 | C3.2 44.7,15.17 v45.93,15.17
  Bottom 0.406: v23.72,12.06 23.72,12.09 C16.2 | C21.2 C19.2 C20.2
  Bottom 0.508: C21.2 27.08,16.3 v26.6,15.82
  Bottom 0.61: C8.2 30.94,41.48 v31.16,41.48
  Bottom 1.27: C18.2 19.94,11.75
  other vias: 51.29,31.83 31.87,41.77 37.53,36.11 37.53,32.44 39.37,32.44 41.2,32.44 55.73,29.76 51.23,23.26 55.73,20.55 46.39,2.04 52.52,11.62 53.65,7.35 53.58,9.4 47.97,8.16 38.47,9.61 38.47,7.14 37.19,6.75 35.21,14.56 35.21,12.12 40.49,17.94 41.2,36.11
  pour GND: -0.27,42.86 58.15,42.86 58.15,-0.32 -0.27,-0.32
  pour Bottom: -0.27,42.86 58.15,42.86 58.15,-0.32 -0.27,-0.32
  pour Top: -0.27,42.86 58.15,42.86 58.15,-0.32 -0.27,-0.32
HALL_1_A  (via drill 0.35)
  Top 0.305: U2.21 42.27,23.63 36.73,18.08 v36.61,18.08
  Bottom 0.305: HALL_A.4 34.82,5.1 33.06,6.85 33.06,15.14 35.21,17.29 35.82,17.29 v36.61,18.08
HALL_1_B  (via drill 0.35)
  Top 0.305: v35.56,18.03 36.35,18.81 36.81,18.81 40.78,22.78 40.78,24.03 U2.20
  Bottom 0.305: v35.56,18.03 35.23,18.03 32.6,15.39 32.6,8.51 29.82,5.73 14.84,5.73 13.86,4.75 HALL_A2.4
HALL_2_A  (via drill 0.35)
  Top 0.305: U2.22 43.56,24.24 43.56,23.52 42.75,22.7 42,22.7 37.63,18.33 v37.63,18
  Bottom 0.305: HALL_A.5 33.6,7.26 33.6,14.98 35.42,16.8 36.56,16.8 37.63,17.87 v37.63,18
HALL_2_B  (via drill 0.35)
  Top 0.305: U2.19 40.01,23.98 40.01,22.72 36.89,19.6 36.64,19.34 35.87,19.34 v35.59,19.06
  Bottom 0.305: v35.59,19.06 32.14,15.61 32.14,8.7 29.63,6.18 14.01,6.18 HALL_A2.5
I2C_SCL
  Top 0.203: U2.10 30.42,30.34 29.61,29.53 29.09,29.53 arc-90 28.8,29.82 arc90 28.43,30.19 27.67,30.19 arc90 27.3,29.82 27.3,29.66 arc-90 27.09,29.45 26.13,29.45 arc-90 25.91,29.66 25.91,29.82 arc90 25.57,30.16 25.28,30.16 arc90 24.94,29.82 arc-90 24.64,29.53 23.43,29.53 21.32,31.64 HALL_A4.4
  Bottom 0.203: HALL_A1.4 HALL_A4.4 HALL_A3.4
I2C_SDA
  Top 0.203: U2.11 31.82,29.02 22.61,29.02 18.78,32.85 HALL_A4.3
  Bottom 0.203: HALL_A1.3 HALL_A4.3 HALL_A3.3
IMU_CLK
  Top 0.203: IMU.23 26.69,17.28 26.88,17.09 31.44,17.09 34.12,19.77 arc90 34.12,20.19 33.72,20.58 arc-90 33.72,21 33.74,21.02 arc-90 34.16,21.02 34.55,20.62 arc90 34.97,20.62 37.2,22.85 U2.17
IMU_CS
  Top 0.203: IMU.22 26.28,17.12 26.68,16.71 31.02,16.71 31.61,16.71 38.62,23.72 38.62,24.11 U2.18
IMU_FSYNC
  Top 0.203: U2.13 29.94,26.53 26.87,23.46 25.77,23.46 25.48,23.17 IMU.11
IMU_INT
  Top 0.203: IMU.12 25.08,23.44 25.45,23.81 26.72,23.81 30.71,27.8 U2.12
IMU_SDI
  Top 0.203: IMU.24 27.29,17.45 31.24,17.45 33.56,19.77 arc90 33.56,20.19 32.54,21.21 arc-90 32.54,21.62 33.19,22.27 arc-90 33.6,22.27 34.62,21.25 arc90 35.04,21.25 35.87,22.09 35.87,24.21 U2.16
IMU_SDO
  Top 0.203: IMU.9 26.28,21.78 26.75,22.26 26.75,22.86 26.99,23.1 28.53,23.1 arc-90 28.82,22.81 28.82,22 arc90 29.12,21.7 29.17,21.7 arc90 29.46,22 29.46,24.21 arc-90 29.75,24.5 29.8,24.5 arc-90 30.1,24.21 30.1,22 arc90 30.39,21.7 30.44,21.7 arc90 30.73,22 30.73,22.81 arc-90 31.02,23.1 31.87,23.95 U2.14
IO0  (via drill 0.35)
  Top 0.406: U2.25 C4.1
  Bottom 0.203: Q2.3 46.51,25.26 U2.25
  Bottom 0.406: C4.1 53.31,25.26 R2.1 55.42,25.27 R3.2
  other vias: 51.23,25.26 48.87,25.26
M1_A
  Top 0.406: MOTOR_DRIVER.2 MOTOR_DRIVER.1 29.62,8.41
  Top 0.61: HALL_A.1 27.2,7.46 28.3,8.57 29.62,8.57 29.62,8.41
M1_B
  Top 0.406: MOTOR_DRIVER.11 MOTOR_DRIVER.12
  Top 0.61: MOTOR_DRIVER.12 29.47,14.92 | 29.47,14.92 29.61,14.92 | 29.61,14.92 MOTOR_DRIVER.11 29.86,14.92 29.61,14.92 | 29.47,14.92 28.62,14.92 27.35,13.65 27.35,10.16 21.48,4.29 HALL_A2.1
M2_A
  Top 0.406: MOTOR_DRIVER.6 29.86,10.78 MOTOR_DRIVER.5
  Top 0.61: HALL_A.2 29.74,6.2 31.16,7.62 31.16,10.8 30.86,11.1 30.18,11.1 29.86,10.78
M2_B
  Top 0.254: MOTOR_DRIVER.8 29.53,12.38 29.26,12.38
  Top 0.406: MOTOR_DRIVER.8 MOTOR_DRIVER.7 29.57,12.06 29.46,12.18
  Top 0.61: 29.46,12.18 29.26,12.38 28.62,12.38 28.3,12.06 28.3,9.84 22.91,4.45 22.91,2.22 22.01,1.32 19.68,1.32 18.94,2.06 HALL_A2.2
M_DRV_AIN1  (via drill 0.35)
  Top 0.203: MOTOR_DRIVER.21 24.46,10.12 24.95,10.6 v24.95,11.18
  Bottom 0.203: v24.95,11.18 25.34,11.18 25.39,11.23 26.17,11.23 33.82,18.88 33.82,24.95 37.23,28.36 48.16,28.36 U2.28
  other vias: 48.87,29.07
M_DRV_AIN2  (via drill 0.35)
  Top 0.203: MOTOR_DRIVER.22 24.32,9.46 25.45,10.6 v25.65,10.6
  Bottom 0.203: v25.65,10.6 26.04,10.6 34.17,18.73 34.17,24.8 37.38,28.01 48.67,28.01 U2.27
  other vias: 48.87,27.8
M_DRV_BIN1  (via drill 0.35)
  Top 0.203: v24.93,12.56 24.77,12.71 MOTOR_DRIVER.17
  Bottom 0.203: v24.93,12.56 26.49,12.56 33.11,19.17 33.11,25.24 36.94,29.07 46.51,29.07 48.87,31.43 U2.30
  other vias: 48.87,31.61
M_DRV_BIN2  (via drill 0.35)
  Top 0.203: v25.71,13.19 25.54,13.37 MOTOR_DRIVER.16
  Bottom 0.203: v25.71,13.19 26.62,13.19 32.75,19.32 32.75,25.39 36.82,29.45 45.62,29.45 48.87,32.7 U2.31
  other vias: 48.87,32.88
M_DRV_PWMA  (via drill 0.35)
  Top 0.203: MOTOR_DRIVER.23 24.78,8.81 25.64,9.67 v25.64,9.69
  Bottom 0.203: v25.64,9.69 34.53,18.58 34.53,24.65 37.53,27.65 47.75,27.65 U2.26
  other vias: 48.87,26.53
M_DRV_PWMB  (via drill 0.35)
  Top 0.203: v26.36,13.83 26.17,14.02 MOTOR_DRIVER.15
  Bottom 0.203: v26.36,13.83 26.75,13.83 32.39,19.47 32.39,25.53 36.67,29.81 44.55,29.81 48.87,34.13 U2.33
  other vias: 48.87,35.42
M_DRV_STBY  (via drill 0.35)
  Top 0.203: MOTOR_DRIVER.19 24.11,11.42 24.62,11.93 25.63,11.93 v25.69,11.86
  Bottom 0.203: v25.69,11.86 26.3,11.86 33.46,19.03 33.46,25.09 37.09,28.72 47.24,28.72 U2.29
  other vias: 48.87,30.34
N$1
  Bottom 0.203: Q2.1 43.82,21.14 45.37,22.69 48.08,22.69 R10.2
N$28  (via drill 0.35)
  Top 0.203: R11.2 54.73,11.3 D7.P$2
  other vias: 54.42,11.62
N$35  (via drill 0.35)
  Top 0.203: R7.2 52.37,18 D5.P$1
  other vias: 52.47,18.1
N$55  (via drill 0.35)
  Top 0.305: R5.2 49.39,10.76 arc90 49.05,11.1 48.13,11.1 arc-90 47.78,11.44 47.78,11.76 arc-90 48.13,12.11 49.05,12.11 arc90 49.39,12.45 U1.11
  other vias: 49.39,9.41
N$56  (via drill 0.35)
  Top 0.305: v46.48,9.48 46.48,11.54 48.2,13.26 U1.12
  Bottom 0.305: R6.2 46.49,9.47 v46.48,9.48
N$61  (via drill 0.35)
  Top 0.406: v53.39,21.27 52.66,20.55 S1.1
  Bottom 0.406: R2.2 53.39,23.31 v53.39,21.27
N$62  (via drill 0.35)
  Top 0.406: v53.07,29.84 52.98,29.76 S2.1
  Bottom 0.406: R1.2 53.45,30.23 v53.07,29.84
N$124  (via drill 0.35)
  Top 0.203: v39.84,19.44 41.98,21.59 v46.27,21.59
  Bottom 0.203: Q3.1 39.65,19.63 v39.84,19.44 | v46.27,21.59 R9.1
N$126  (via drill 0.35)
  Top 0.203: v50.87,16.44 U1.17
  Bottom 0.203: D5.P$2 51.04,16.26 v50.87,16.44
  other vias: 54.72,16.26
N$127  (via drill 0.35)
  Top 0.203: D6.P$2 54.54,13.31 53.73,12.51 51.32,12.51 v50.61,11.8 | v44.63,12.53 U1.10
  Bottom 0.203: v50.61,11.8 45.36,11.8 v44.63,12.53
N$129  (via drill 0.35)
  Top 0.203: D6.P$1 52.37,14.74 R8.2
  other vias: 52.5,14.87
REGOUT  (via drill 0.35)
  Top 0.203: IMU.10 25.88,22.39 v26.12,22.64
  Bottom 0.203: v26.12,22.64 26.12,21.84 25.27,20.99 C20.1
RTS  (via drill 0.35)
  Top 0.203: U1.2 42.6,17.72 v42.45,17.87
  Top 0.305: U1.2 46.09,17.71 46.26,17.88 v46.26,17.92
  Bottom 0.203: Q3.2 37.96,20.66 39.66,20.66 v42.45,17.87
  Bottom 0.305: v46.26,17.92 46.79,17.92 48.56,19.7 R10.1
RXD0
  Top 0.305: U1.20 47.41,20.51 47.41,36.08 48.02,36.69 U2.34
TXD0
  Top 0.305: U1.4 45.78,16.44 46.95,17.6 46.95,36.77 48.14,37.96 U2.35
USB_5V  (via drill 0.35)
  Top 0.305: v48.59,3.49 48.59,4.08 J1.5 48.44,5.66 D1.2 49.54,6.76 D4.P$1 51.06,6.76 C6.1
  Bottom 0.305: C7.1 48.39,3.29 v48.59,3.49
  other vias: 51.65,7.35
USB_DM  (via drill 0.35)
  Top 0.305: v47.33,6.76 D2.P$1 47.97,5.8 47.52,5.35 47.52,5.16 47.79,4.89 J1.4
  Bottom 0.305: C2.1 44.36,7.53 R6.1 46.49,7.51 46.59,7.51 v47.33,6.76
USB_DP  (via drill 0.35)
  Top 0.305: J1.3 47.06,4.31 47.06,6.07 D3.P$1 47.13,7.53 47.63,7.53 47.68,7.48 49.22,7.48 v49.23,7.46
  Bottom 0.305: C1.1 51.28,9.4 R5.1 49.28,7.51 v49.23,7.46
V_BAT
  Top 1.626: CONV_3V3.VIN 8.15,9.05 3.54,13.65 3.54,24.18 Q1.1 10.69,19.86 CONV_6V.3
VCC  (via drill 0.35)
  Top 0.203: IMU.8 26.68,21.61 v27.38,22.32 | v23.68,20 23.89,20.21 IMU.13 | v24.07,10.77
  Top 0.254: IMU.1 27.75,18.08 v28.26,18.08 | U1.14 49.6,14.56 v50.89,14.56 | D7.P$1 51.77,10.73 v51.11,10.73
  Top 0.305: v24.07,10.77 MOTOR_DRIVER.20 22.58,10.8 v21.32,10.8 | 44.68,17.03 U1.3 v43.34,17.07 | C12.1 37.23,14.54 37.27,14.54 | 41.98,15.91 v42.2,15.91 | v36.75,10.68 36.64,10.68 | U3.2 39.65,13.58 v42.17,13.58 | v42.17,10.83 v39.51,10.83 v39.5,10.84 | v38.79,14.87 40.83,14.87 v40.88,14.82 | v40.88,12.79 40.85,12.76 v38.77,12.76
  Top 0.406: C9.1 32.01,40.64 U2.2 30.07,40.5 29.55,39.98 v29.55,39.03
  VCC 0.406: 33.78,40.06 32.29,40.06
  Bottom 0.203: C19.1 24.16,20 v23.68,20 | C16.1 24.08,10.8 v24.08,10.77 v24.07,10.77
  Bottom 0.254: v51.11,10.73 51.32,10.93 51.32,11.27 51.29,11.25 51.29,14.16 v50.89,14.56
  Bottom 0.305: C15.1 21.32,10.59 v21.32,10.8 | 44.78,17.25 C3.1 44.46,17.07 v43.34,17.07
  Bottom 0.406: C19.1 C21.1 25.08,16.77 v24.81,16.51 | C8.1 29.66,39.13 v29.55,39.03
  other vias: 55.61,31.88 55.48,23.31 54.4,14.87 54.37,18.1 37.21,14.56 37.21,12.12 40.49,15.94 36.84,15.96 33.78,40.64
  pour VCC: -0.27,42.86 58.15,42.86 58.15,-0.32 -0.27,-0.32